# Altium schematic sheet STM32.SchDoc
size A; SheetNumber: 8; SheetTotal: 10
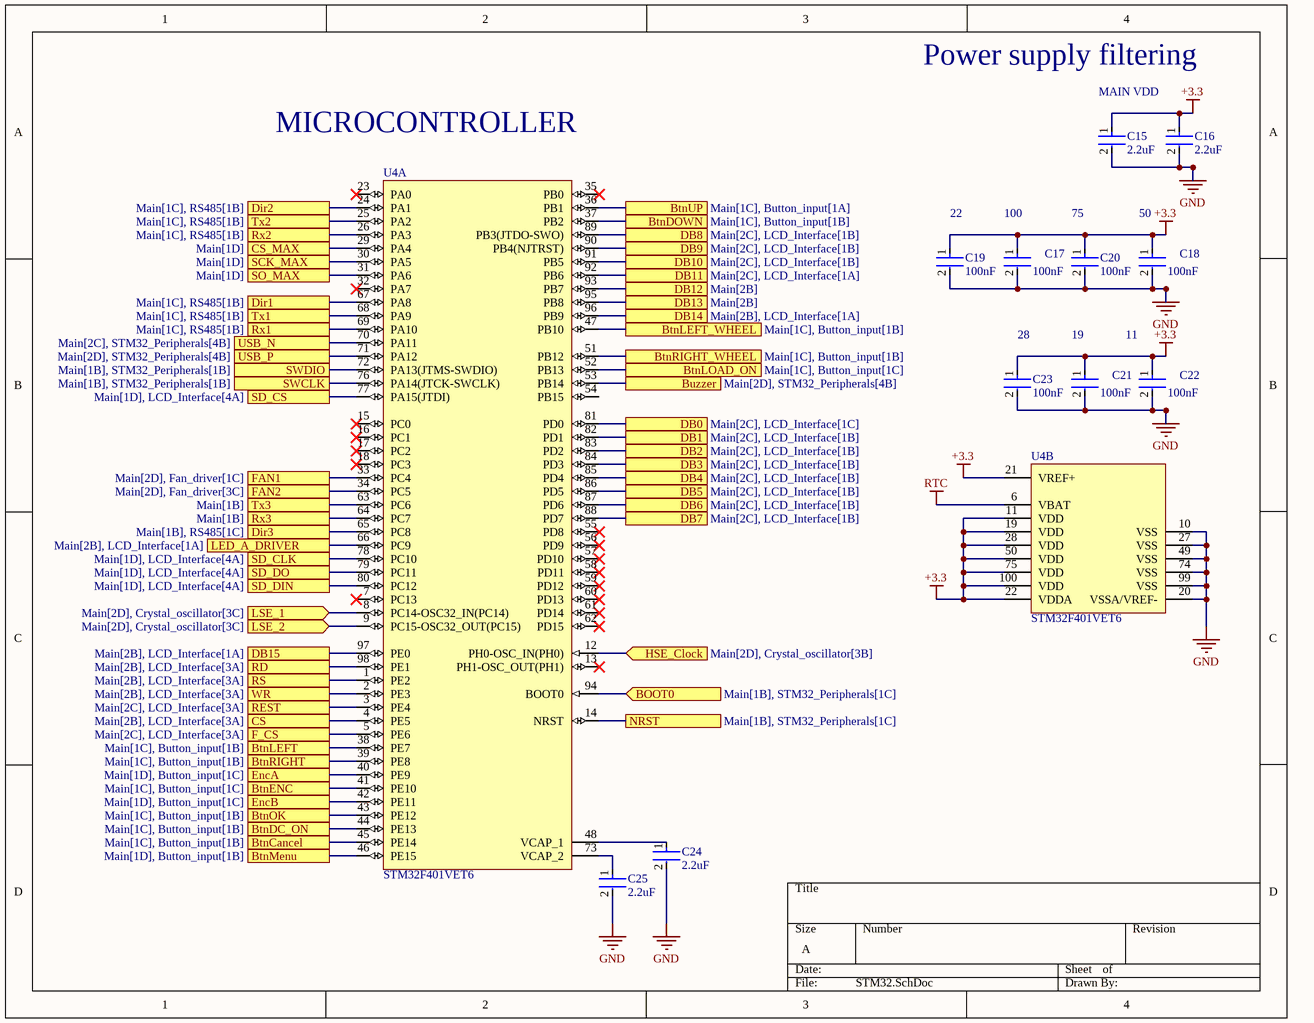
[diagram p0: STM32.SchDoc]

## Parts
C15  2.2uF  [FP-0805-L_2_01_0_2-W_1_25-IPC_B]
C16  2.2uF  [FP-0805-L_2_01_0_2-W_1_25-IPC_B]
C17  100nF  [FP-CGA3E-0_3-0_1-IPC_A]
C18  100nF  [FP-CGA3E-0_3-0_1-IPC_A]
C19  100nF  [FP-CGA3E-0_3-0_1-IPC_A]
C20  100nF  [FP-CGA3E-0_3-0_1-IPC_A]
C21  100nF  [FP-CGA3E-0_3-0_1-IPC_A]
C22  100nF  [FP-CGA3E-0_3-0_1-IPC_A]
C23  100nF  [FP-CGA3E-0_3-0_1-IPC_A]
C24  2.2uF  [FP-0805-L_2_01_0_2-W_1_25-IPC_B]
C25  2.2uF  [FP-0805-L_2_01_0_2-W_1_25-IPC_B]
U4  STM32F401VET6  [STM-LQFP100_L]  (parts A,B of 2)

## Ports
BOOT0 (in, see Main[1B], STM32_Peripherals[1C]), BtnCancel (see Main[1C], Button_input[1B]), BtnDC_ON (see Main[1C], Button_input[1B]), BtnDOWN (see Main[1C], Button_input[1B]), BtnENC (see Main[1C], Button_input[1C]), BtnLEFT (see Main[1C], Button_input[1B]), BtnLEFT_WHEEL (see Main[1C], Button_input[1B]), BtnLOAD_ON (see Main[1C], Button_input[1C]), BtnMenu (see Main[1D], Button_input[1B]), BtnOK (see Main[1C], Button_input[1B]), BtnRIGHT (see Main[1C], Button_input[1B]), BtnRIGHT_WHEEL (see Main[1C], Button_input[1B]), BtnUP (see Main[1C], Button_input[1A]), Buzzer (see Main[2D], STM32_Peripherals[4B]), CS (see Main[2B], LCD_Interface[3A]), CS_MAX (see Main[1D]), DB0 (see Main[2C], LCD_Interface[1C]), DB1 (see Main[2C], LCD_Interface[1B]), DB2 (see Main[2C], LCD_Interface[1B]), DB3 (see Main[2C], LCD_Interface[1B]), DB4 (see Main[2C], LCD_Interface[1B]), DB5 (see Main[2C], LCD_Interface[1B]), DB6 (see Main[2C], LCD_Interface[1B]), DB7 (see Main[2C], LCD_Interface[1B]), DB8 (see Main[2C], LCD_Interface[1B]), DB9 (see Main[2C], LCD_Interface[1B]), DB10 (see Main[2C], LCD_Interface[1B]), DB11 (see Main[2C], LCD_Interface[1A]), DB12 (see Main[2B]), DB13 (see Main[2B]), DB14 (see Main[2B], LCD_Interface[1A]), DB15 (see Main[2B], LCD_Interface[1A]), Dir1 (see Main[1C], RS485[1B]), Dir2 (see Main[1C], RS485[1B]), Dir3 (see Main[1B], RS485[1C]), EncA (see Main[1D], Button_input[1C]), EncB (see Main[1D], Button_input[1C]), F_CS (see Main[2C], LCD_Interface[3A]), FAN1 (see Main[2D], Fan_driver[1C]), FAN2 (see Main[2D], Fan_driver[3C]), HSE_Clock (in, see Main[2D], Crystal_oscillator[3B]), LED_A_DRIVER (see Main[2B], LCD_Interface[1A]), LSE_1 (in, see Main[2D], Crystal_oscillator[3C]), LSE_2 (in, see Main[2D], Crystal_oscillator[3C]), NRST (see Main[1B], STM32_Peripherals[1C]), RD (see Main[2B], LCD_Interface[3A]), REST (see Main[2C], LCD_Interface[3A]), RS (see Main[2B], LCD_Interface[3A]), Rx1 (see Main[1C], RS485[1B]), Rx2 (see Main[1C], RS485[1B]), Rx3 (see Main[1B]), SCK_MAX (see Main[1D]), SD_CLK (see Main[1D], LCD_Interface[4A]), SD_CS (see Main[1D], LCD_Interface[4A]), SD_DIN (see Main[1D], LCD_Interface[4A]), SD_DO (see Main[1D], LCD_Interface[4A]), SO_MAX (see Main[1D]), SWCLK (see Main[1B], STM32_Peripherals[1B]), SWDIO (see Main[1B], STM32_Peripherals[1B]), Tx1 (see Main[1C], RS485[1B]), Tx2 (see Main[1C], RS485[1B]), Tx3 (see Main[1B]), USB_N (see Main[2C], STM32_Peripherals[4B]), USB_P (see Main[2D], STM32_Peripherals[4B]), WR (see Main[2B], LCD_Interface[3A])

## Nets
+3.3: C15.1 C16.1 C17.1 C18.1 C19.1 C20.1 C21.1 C22.1 C23.1 U4.11(VDD) U4.19(VDD) U4.21(VREF+) U4.22(VDDA) U4.28(VDD) U4.50(VDD) U4.75(VDD) U4.100(VDD)
GND: C15.2 C16.2 C17.2 C18.2 C19.2 C20.2 C21.2 C22.2 C23.2 C24.2 C25.2 U4.10(VSS) U4.20(VSSA/VREF-) U4.27(VSS) U4.49(VSS) U4.74(VSS) U4.99(VSS)
RTC: U4.6(VBAT)
BOOT0: U4.94(BOOT0) ; port BOOT0
BtnCancel: U4.45(PE14) ; port BtnCancel
BtnDC_ON: U4.44(PE13) ; port BtnDC_ON
BtnDOWN: U4.37(PB2) ; port BtnDOWN
BtnENC: U4.41(PE10) ; port BtnENC
BtnLEFT: U4.38(PE7) ; port BtnLEFT
BtnLEFT_WHEEL: U4.47(PB10) ; port BtnLEFT_WHEEL
BtnLOAD_ON: U4.52(PB13) ; port BtnLOAD_ON
BtnMenu: U4.46(PE15) ; port BtnMenu
BtnOK: U4.43(PE12) ; port BtnOK
BtnRIGHT: U4.39(PE8) ; port BtnRIGHT
BtnRIGHT_WHEEL: U4.51(PB12) ; port BtnRIGHT_WHEEL
BtnUP: U4.36(PB1) ; port BtnUP
Buzzer: U4.53(PB14) ; port Buzzer
CS: U4.4(PE5) ; port CS
CS_MAX: U4.29(PA4) ; port CS_MAX
DB0: U4.81(PD0) ; port DB0
DB1: U4.82(PD1) ; port DB1
DB2: U4.83(PD2) ; port DB2
DB3: U4.84(PD3) ; port DB3
DB4: U4.85(PD4) ; port DB4
DB5: U4.86(PD5) ; port DB5
DB6: U4.87(PD6) ; port DB6
DB7: U4.88(PD7) ; port DB7
DB8: U4.89(PB3(JTDO-SWO)) ; port DB8
DB9: U4.90(PB4(NJTRST)) ; port DB9
DB10: U4.91(PB5) ; port DB10
DB11: U4.92(PB6) ; port DB11
DB12: U4.93(PB7) ; port DB12
DB13: U4.95(PB8) ; port DB13
DB14: U4.96(PB9) ; port DB14
DB15: U4.97(PE0) ; port DB15
Dir1: U4.67(PA8) ; port Dir1
Dir2: U4.24(PA1) ; port Dir2
Dir3: U4.65(PC8) ; port Dir3
EncA: U4.40(PE9) ; port EncA
EncB: U4.42(PE11) ; port EncB
F_CS: U4.5(PE6) ; port F_CS
FAN1: U4.33(PC4) ; port FAN1
FAN2: U4.34(PC5) ; port FAN2
HSE_Clock: U4.12(PH0-OSC_IN(PH0)) ; port HSE_Clock
LED_A_DRIVER: U4.66(PC9) ; port LED_A_DRIVER
LSE_1: U4.8(PC14-OSC32_IN(PC14)) ; port LSE_1
LSE_2: U4.9(PC15-OSC32_OUT(PC15)) ; port LSE_2
NRST: U4.14(NRST) ; port NRST
RD: U4.98(PE1) ; port RD
REST: U4.3(PE4) ; port REST
RS: U4.1(PE2) ; port RS
Rx1: U4.69(PA10) ; port Rx1
Rx2: U4.26(PA3) ; port Rx2
Rx3: U4.64(PC7) ; port Rx3
SCK_MAX: U4.30(PA5) ; port SCK_MAX
SD_CLK: U4.78(PC10) ; port SD_CLK
SD_CS: U4.77(PA15(JTDI)) ; port SD_CS
SD_DIN: U4.80(PC12) ; port SD_DIN
SD_DO: U4.79(PC11) ; port SD_DO
SO_MAX: U4.31(PA6) ; port SO_MAX
SWCLK: U4.76(PA14(JTCK-SWCLK)) ; port SWCLK
SWDIO: U4.72(PA13(JTMS-SWDIO)) ; port SWDIO
Tx1: U4.68(PA9) ; port Tx1
Tx2: U4.25(PA2) ; port Tx2
Tx3: U4.63(PC6) ; port Tx3
USB_N: U4.70(PA11) ; port USB_N
USB_P: U4.71(PA12) ; port USB_P
WR: U4.2(PE3) ; port WR
NetC24_1: C24.1 U4.48(VCAP_1)
NetC25_1: C25.1 U4.73(VCAP_2)

Not connected (* = marked no-connect by the designer): U4 7(PC13)* 13(PH1-OSC_OUT(PH1))* 15(PC0)* 16(PC1)* 17(PC2)* 18(PC3)* 23(PA0)* 32(PA7)* 35(PB0)* 54(PB15) 55(PD8)* 56(PD9)* 57(PD10)* 58(PD11)* 59(PD12)* 60(PD13)* 61(PD14)* 62(PD15)*

## Notes on the sheet
- Power supply filtering
- MAIN VDD
- MICROCONTROLLER
- (near C19) 22
- (near C17) 100
- (near C20) 75
- (near C18) 50
- (near C23) 28
- (near C21) 19
- 11

## Library data of the parts
C15 C16 C24 C25 = CMP-2007-04174-2: General Purpose Ceramic Capacitor, 0805, 10nF, 10%, X7R, 15%, 100V; Capacitance: 100nF; Packaging: Tape and Reel; Min Operating Temperature: -55°C; Dielectric Material: Ceramic; Height: 1.4mm; Voltage Rating: 100V; Termination: SMD/SMT; Case Code (Imperial): 0805; Case Code (Metric): 2012; Case/Package: 0805; Construction: Flat; Radiation Hardening: No; Series: -; Dielectric: X7R; Package Quantity: 2000; Mount: Surface Mount; Contact Plating: Tin; Voltage: 100V; Lead Free: Lead Free; Depth: 1.25mm; RoHS Compliant: Yes; Number of Pins: 2; Max Operating Temperature: 125°C; Length: 2.01mm; Voltage Rating (DC): 100V; Thickness: 0.055inch; REACH SVHC: No SVHC; Width: 0.049inch; Tolerance: 10%
C17-C23 = CMP-2000-07546-2: Cap Ceramic 100nF 50V X7R 10% Pad SMD 0603 +125°C Automotive T/R; Weight: 7.1E-05oz; Composition: Ceramic; Max Operating Temperature: 125°C; Termination: SMD/SMT; Dielectric: X7R; Length: 1.6mm; Package Quantity: 1; REACH SVHC: No SVHC; Lead Free: Lead Free; Case Code (Metric): 1608; Min Operating Temperature: -55°C; Packaging: Tape and Reel; Tolerance: 10%; Voltage Rating: 50V; Case Code (Imperial): 0603; Capacitance: 100nF; Case/Package: 0603; Voltage Rating (DC): 50V; Depth: 0.8mm; Radiation Hardening: No; Ratings: AEC-Q200; Mount: Surface Mount; Voltage: 50V; Thickness: 0.035inch; Width: 0.8mm; Height: 0.8mm
U4 = CMP-0243-00155-1: ARM Cortex-M4 32-bit MCU+FPU, 512 KB Flash, 96 KB Internal RAM, 81 I/Os, 100-Pin LQFP, -40 to 85 degC, Tray; Internal RAM Size (kB): 96; Operating Frequency(F) (Processor speed) (MHz): 84; FLASH Size (Prog) (kB): 512; Supply Voltage(Vcc) min (V): 1.7; I/Os (High Current): 81; Mounting Technology: Surface Mount; DatasheetVersion: Rev. 3; Packing: Tray; ComponentLink2Description: Datasheet; ComponentLink1URL: http://www.st.com/; ComponentLink1Description: Manufacturer URL; Core: ARM Cortex-M4; Package Reference: 100-Pin Low Profile Quad Flat Package, Body 14 x 14 mm, Pitch 0.5 mm; ComponentLink2URL: http://www.st.com/st-web-ui/static/active/en/resource/technical/document/datasheet/DM00102166.pdf; Package Description: LQFP100